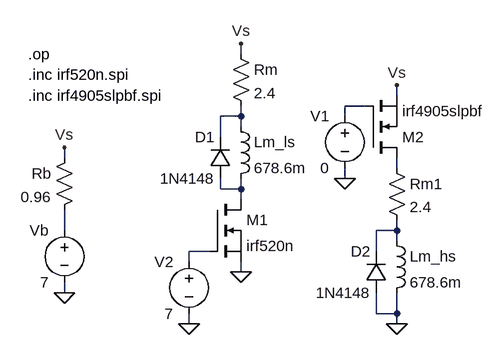
[diagram p0: schematic fet-selection.asc]
fet-selection.asc, the LTspice schematic file:
Version 4
SHEET 1 1412 680
WIRE 352 -96 352 -112
WIRE 592 -32 592 -48
WIRE 544 -16 512 -16
WIRE 352 0 352 -16
WIRE 352 0 320 0
WIRE 512 0 512 -16
WIRE 352 16 352 0
WIRE 320 32 320 0
WIRE 80 64 80 48
WIRE 592 80 592 64
WIRE 512 96 512 80
WIRE 320 112 320 96
WIRE 352 112 352 96
WIRE 352 112 320 112
WIRE 352 128 352 112
WIRE 80 176 80 144
WIRE 592 176 592 160
WIRE 592 176 560 176
WIRE 592 192 592 176
WIRE 304 208 272 208
WIRE 560 208 560 176
WIRE 272 224 272 208
WIRE 352 240 352 224
WIRE 80 272 80 256
WIRE 560 304 560 272
WIRE 592 304 592 272
WIRE 592 304 560 304
WIRE 272 320 272 304
WIRE 592 320 592 304
FLAG 80 272 0
FLAG 80 48 Vs
FLAG 352 240 0
FLAG 352 -112 Vs
FLAG 272 320 0
FLAG 512 96 0
FLAG 592 320 0
FLAG 592 -48 Vs
SYMBOL voltage 80 160 M0
SYMATTR InstName Vb
SYMATTR Value 7
SYMBOL res 96 48 M0
SYMATTR InstName Rb
SYMATTR Value 0.96
SYMBOL res 336 -112 R0
SYMATTR InstName Rm
SYMATTR Value 2.4
SYMBOL ind 336 0 R0
SYMATTR InstName Lm_ls
SYMATTR Value 678.6m
SYMBOL nmos 304 128 R0
SYMATTR InstName M1
SYMATTR Value irf520n
SYMATTR Prefix X
SYMBOL voltage 272 208 M0
SYMATTR InstName V2
SYMATTR Value 7
SYMBOL diode 336 96 R180
WINDOW 0 24 64 Left 2
WINDOW 3 24 0 Left 2
SYMATTR InstName D1
SYMATTR Value 1N4148
SYMBOL res 576 64 R0
SYMATTR InstName Rm1
SYMATTR Value 2.4
SYMBOL ind 576 176 R0
SYMATTR InstName Lm_hs
SYMATTR Value 678.6m
SYMBOL nmos 544 64 M180
SYMATTR InstName M2
SYMATTR Value irf4905slpbf
SYMATTR Prefix X
SYMBOL voltage 512 -16 M0
WINDOW 123 0 0 Left 0
WINDOW 39 0 0 Left 0
SYMATTR InstName V1
SYMATTR Value 0
SYMBOL diode 576 272 R180
WINDOW 0 24 64 Left 2
WINDOW 3 24 0 Left 2
SYMATTR InstName D2
SYMATTR Value 1N4148
TEXT 24 -64 Left 2 !.inc irf520n.spi
TEXT 24 -32 Left 2 !.inc irf4905slpbf.spi
TEXT 24 -96 Left 2 !.op

The netlist it stands for:
* fet-selection.asc
Vb N005 0 7
Rb Vs N005 0.96
Rm Vs N002 2.4
Lm_ls N002 N004 678.6m
XM1 N004 N007 0 irf520n  ; pins D G S
V2 N007 0 7
D1 N004 N002 1N4148
Rm1 N003 N006 2.4
Lm_hs N006 0 678.6m
XM2 N003 N001 Vs irf4905slpbf  ; pins D G S
V1 N001 0 0
D2 0 N006 1N4148
.model D D
.lib standard.dio
.inc irf520n.spi
.inc irf4905slpbf.spi
.op
.backanno
.end